# Altium schematic sheet fpga_configuration.SchDoc: Spartan-6 FPGA Configuration
size A; Engineer: A. Peck; Organization: UCLA High Energy Physics; DocumentNumber: 5; Revision: 3.0; SheetNumber: 5; SheetTotal: 15; Project: LCT Comparator Tester
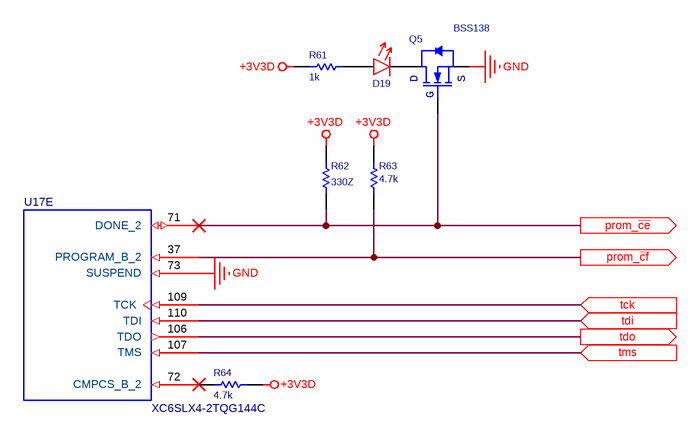
[diagram p0: fpga_configuration.SchDoc]

## Parts
D19  LITEON/LTST-C171KRKT  [LED0805]  (value not drawn)
Q5  BSS138  [SOT23]
R61  1k  [R0603]
R62  330Z  [R0603]
R63  4.7k  [R0603]
R64  4.7k  [R0603]
U17  XC6SLX4-2TQG144C  [TQFP-144]  (value not drawn)  (part E of 7)

## Ports
prom_~{ce} (out), prom_~{cf} (out), tck (in), tdi (in), tdo (out), tms (in)

## Nets
+3V3D: R61.1 R62.2 R63.2 R64.2
GND: Q5.2(S) U17.73(SUSPEND)
prom_~{ce}: Q5.1(G) R62.1 U17.71(DONE_2) ; port prom_~{ce}
prom_~{cf}: R63.1 U17.37(PROGRAM_B_2) ; port prom_~{cf}
tck: U17.109(TCK) ; port tck
tdi: U17.110(TDI) ; port tdi
tdo: U17.106(TDO) ; port tdo
tms: U17.107(TMS) ; port tms
NetD19_A: D19.A R61.2
NetD19_C: D19.C Q5.3(D)
NetR64_1: R64.1 U17.72(CMPCS_B_2)

## Notes on the sheet
- Date:
- Rev:
- of
- Sheet

## Library data of the parts
D19 = LITEON/LTST-C171KRKT: LED, 20mA, 0805, Red; Supplier 1: Digi-Key; Supplier Part Number 1: 160-1427-1-ND
Q5 = Fairchild/BSS138: Trans, nFet, 50V, 220mA, SOT-23; Manufacturer: Fairchild Semiconductor; FET Type: MOSFET N-Channel, Metal Oxide; FET Feature: Logic Level Gate; Current - Continuous Drain (Id) @ 25°C: 220mA (Ta); Rds On (Max) @ Id, Vgs: 3.5 Ohm @ 220mA, 10V; Vgs(th) (Max) @ Id: 1.5V @ 1mA; Gate Charge (Qg) @ Vgs: 2.4nC @ 10V; Input Capacitance (Ciss) @ Vds: 27pF @ 25V; Power - Max: 360mW; Supplier 1: Digi-Key; Manufacturer Part Number: BSS138; RoHS: RoHS Compliant; Category: Discrete Semiconductor Products; Stock 1: 524637; Pricing 1: 1=0.22, 10=0.178, 100=0.0945, 500=0.06214, 1000=0.04234 (USD); Packaging: Cut Tape (CT); Drain to Source Voltage (Vdss): 50V; Operating Temperature: -55°C ~ 150°C (TJ); Mounting Type: Surface Mount; Package / Case: TO-236-3, SC-59, SOT-23-3; Supplier Device Package: SOT-23-3; ComponentLink1URL: http://www.fairchildsemi.com/datasheets/BS/BSS138.pdf; ComponentLink1Description: http://www.fairchildsemi.com/datasheets/BS/BSS138.pdf; Supplier 2: Newark; Supplier Part Number 1: BSS138CT-ND; Supplier Part Number 2: 58K8769
R61 = CRCW06031K00FKEA: RES1, SMD, 1.00k, 1.0%, 1/10W, 0603; Manufacturer: Vishay Dale; Tolerance: ±1%; Power (Watts): 0.1W, 1/10W; Temperature Coefficient: ±100ppm/°C; Supplier 1: Digi-Key; Manufacturer Part Number: CRCW06031K00FKEA; RoHS: RoHS Compliant; Category: Resistors; Stock 1: 770011; Pricing 1: 1=0.1, 10=0.03, 25=0.022, 50=0.0168, 100=0.0123, 250=0.0094, 500=0.00752, 1000=0.00554, 2500=0.00481 (USD); Packaging: Cut Tape (CT); Resistance (Ohms): 1k; Composition: Thick Film; Features: Automotive AEC-Q200; Operating Temperature: -55°C ~ 155°C; Package / Case: 0603 (1608 Metric); Supplier Device Package: 0603; Size / Dimension: 0.061" L x 0.033" W (1.55mm x 0.85mm); Height: 0.020" (0.50mm); Number of Terminations: 2; ComponentLink1URL: http://www.vishay.com/docs/20035/dcrcwe3.pdf; ComponentLink1Description: http://www.vishay.com/docs/20035/dcrcwe3.pdf; Supplier Part Number 1: 541-1.00KHCT-ND; Supplier 2: Newark; Supplier Part Number 2: 52K8015
R62 = CRCW0603330RFKEA: RES0, SMD,  330Z, 1.0%, 1/10W, 0603; Manufacturer: Rohm Semiconductor; Manufacturer Part Number: MCR03ERTF3300; Resistance (Ohms): 330; Tolerance: ±1%; Power (Watts): 0.1W, 1/10W; Temperature Coefficient: ±100ppm/°C; Supplier 1: Digi-Key; RoHS: RoHS Compliant; Category: Resistors; Stock 1: 139947; Pricing 1: 1=0.1, 10=0.011, 25=0.0084, 100=0.0047, 250=0.00356, 500=0.00286, 1000=0.0021 (USD); Packaging: Cut Tape (CT); Composition: Thick Film; Features: -; Operating Temperature: -55°C ~ 155°C; Package / Case: 0603 (1608 Metric); Supplier Device Package: 0603 (1608 Metric); Size / Dimension: 0.063" L x 0.031" W (1.60mm x 0.80mm); Height: 0.022" (0.55mm); Number of Terminations: 2; ComponentLink1URL: http://rohmfs.rohm.com/en/products/databook/datasheet/passive/resistor/chip_resistor/mcr_g.pdf; ComponentLink1Description: http://rohmfs.rohm.com/en/products/databook/datasheet/passive/resistor/chip_resistor/mcr_g.pdf; Supplier Part Number 1: RHM330CFCT-ND
R63 R64 = CRCW06034K70FKEA: RES1, SMD, 4.70k, 1.0%, 1/10W, 0603; Manufacturer: Vishay Dale; Tolerance: ±1%; Power (Watts): 0.1W, 1/10W; Temperature Coefficient: ±100ppm/°C; Supplier 1: Digi-Key; Supplier Part Number 1: 541-4.70KHCT-ND; Manufacturer Part Number: CRCW06034K70FKEA; RoHS: RoHS Compliant; Category: Resistors; Packaging: Cut Tape (CT); Part Status: Active; Resistance (Ohms): 4.7k; Composition: Thick Film; Features: Automotive AEC-Q200; Operating Temperature: -55°C ~ 155°C; Package / Case: 0603 (1608 Metric); Supplier Device Package: 0603; Size / Dimension: 0.063" L x 0.033" W (1.60mm x 0.85mm); Height - Seated (Max): 0.020" (0.50mm); Number of Terminations: 2; Failure Rate: -; ComponentLink1URL: http://www.vishay.com/docs/20035/dcrcwe3.pdf; ComponentLink1Description: http://www.vishay.com/docs/20035/dcrcwe3.pdf; Stock 1: 413202; Pricing 1: 1=0.1, 10=0.03, 25=0.022, 50=0.0168, 100=0.0123, 250=0.0094, 500=0.00752, 1000=0.00554, 2500=0.00481 (USD)
U17 = Xilinx/FPGA-XSP6-XC6SLX9-SQ144: FPGA, Spartan-6 LX 1.2V, 102 User I/Os, 144-Pin TQFP (0.5mm Pitch), Speed Grade 2, Commercial Grade, Pb-Free; PackageReference: TQG144; Code_JEDEC: MS-026-BFB; DatasheetVersion: ver1.6, Nov-2010; PackageVersion: ver1.2, Jun-2004; PackageDescription: 144-Pin Thin Quad Flat Pack (TQG144) - Pb-Free; Supplier 1: Digi-Key; Supplier Part Number 1: 122-1734-ND